# EAGLE design stm32f765-M7 (EAGLE 9.3.0)
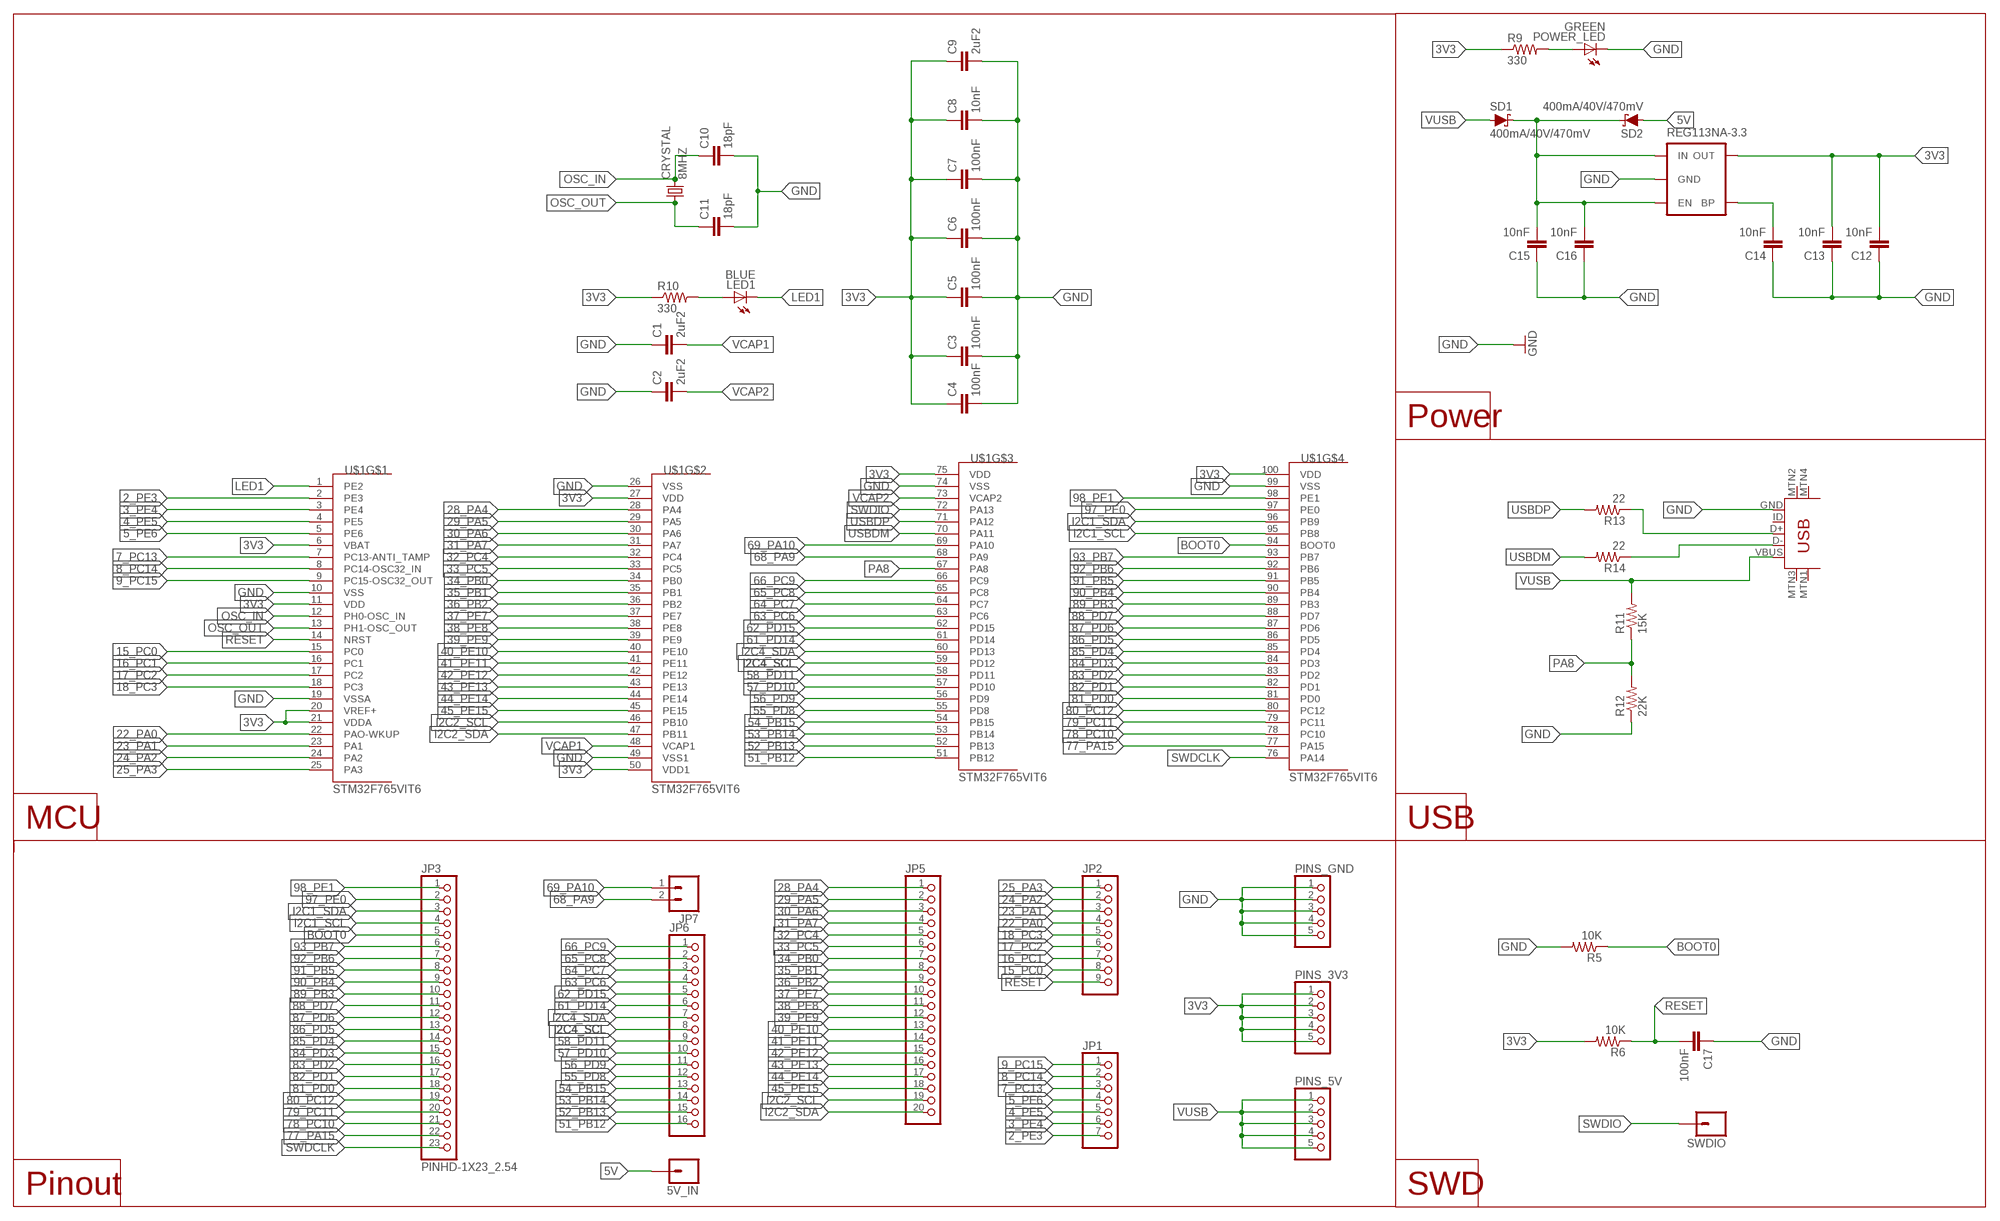
[diagram p0: schematic, sheet 1]

## Parts
5V_IN  M01PTH_LONGPAD  [1X01_LONGPAD]
C1  2uF2  CAP1206  [1206]
C2  2uF2  CAP1206  [1206]
C3  100nF  CAP1206  [1206]
C4  100nF  CAP1206  [1206]
C5  100nF  CAP1206  [1206]
C6  100nF  CAP1206  [1206]
C7  100nF  CAP1206  [1206]
C8  10nF  CAP1206  [1206]
C9  2uF2  CAP1206  [1206]
C10  18pF  CAP1206  [1206]
C11  18pF  CAP1206  [1206]
C12  10nF  CAP1206  [1206]
C13  10nF  CAP1206  [1206]
C14  10nF  CAP1206  [1206]
C15  10nF  CAP1206  [1206]
C16  10nF  CAP1206  [1206]
C17  100nF  CAP1206  [1206]
CRYSTAL  8MHZ  CSM-7X-DU  [CSM-7X-DU]
JP1  PINHD-1X07_2.54  [1X07]
JP2  PINHD-1X09_2.54  [1X09]
JP3  PINHD-1X23_2.54  [1X23]
JP5  PINHD-1X20_2.54  [1X20]
JP6  PINHD-1X16_2.54  [1X16]
JP7  M02  [1X02_LONGPADS]
LED1  BLUE  LED1206  [1206]
PINS_3V3  PINHD-1X05_2.54  [1X05]
PINS_5V  PINHD-1X05_2.54  [1X05]
PINS_GND  PINHD-1X05_2.54  [1X05]
POWER_LED  GREEN  LED1206  [1206]
R5  10K  RESISTOR1206  [1206]
R6  10K  RESISTOR1206  [1206]
R9  330  RESISTOR1206  [1206]
R10  330  RESISTOR1206  [1206]
R11  15K  RESISTOR1206  [1206]
R12  22K  RESISTOR1206  [1206]
R13  22  RESISTOR1206  [1206]
R14  22  RESISTOR1206  [1206]
REG113NA-3.3  V_REG_LDOSMD  [SOT23-5]
SD1  400mA/40V/470mV  DIODE-SCHOTTKY-ZLLS500  [SOT23-3]
SD2  400mA/40V/470mV  DIODE-SCHOTTKY-ZLLS500  [SOT23-3]
SWDIO  M01PTH_LONGPAD  [1X01_LONGPAD]
U$1  STM32F765VIT6  [LQFP100]
U$7  USB-MINIB-5PIN  [USB-MINIB]

## Nets
2_PE3: JP1.7 U$1.2(PE3)
3_PE4: JP1.6 U$1.3(PE4)
3V3: C3.1 C4.1 C5.1 C6.1 C7.1 C8.1 C9.1 C12.2 C13.2 PINS_3V3.1 PINS_3V3.2 PINS_3V3.3 PINS_3V3.4 PINS_3V3.5 R6.2 R9.1 R10.1 REG113NA-3.3.5(OUT) U$1.6(VBAT) U$1.11(VDD) U$1.20(VREF+) U$1.21(VDDA) U$1.27(VDD) U$1.50(VDD1) U$1.75(VDD) U$1.100(VDD)
4_PE5: JP1.5 U$1.4(PE5)
5_PE6: JP1.4 U$1.5(PE6)
5V: 5V_IN.1 SD2.1(A)
7_PC13: JP1.3 U$1.7(PC13-ANTI_TAMP)
8_PC14: JP1.2 U$1.8(PC14-OSC32_IN)
9_PC15: JP1.1 U$1.9(PC15-OSC32_OUT)
15_PC0: JP2.8 U$1.15(PC0)
16_PC1: JP2.7 U$1.16(PC1)
17_PC2: JP2.6 U$1.17(PC2)
18_PC3: JP2.5 U$1.18(PC3)
22_PA0: JP2.4 U$1.22(PAO-WKUP)
23_PA1: JP2.3 U$1.23(PA1)
24_PA2: JP2.2 U$1.24(PA2)
25_PA3: JP2.1 U$1.25(PA3)
28_PA4: JP5.1 U$1.28(PA4)
29_PA5: JP5.2 U$1.29(PA5)
30_PA6: JP5.3 U$1.30(PA6)
31_PA7: JP5.4 U$1.31(PA7)
32_PC4: JP5.5 U$1.32(PC4)
33_PC5: JP5.6 U$1.33(PC5)
34_PB0: JP5.7 U$1.34(PB0)
35_PB1: JP5.8 U$1.35(PB1)
36_PB2: JP5.9 U$1.36(PB2)
37_PE7: JP5.10 U$1.37(PE7)
38_PE8: JP5.11 U$1.38(PE8)
39_PE9: JP5.12 U$1.39(PE9)
40_PE10: JP5.13 U$1.40(PE10)
41_PE11: JP5.14 U$1.41(PE11)
42_PE12: JP5.15 U$1.42(PE12)
43_PE13: JP5.16 U$1.43(PE13)
44_PE14: JP5.17 U$1.44(PE14)
45_PE15: JP5.18 U$1.45(PE15)
51_PB12: JP6.16 U$1.51(PB12)
52_PB13: JP6.15 U$1.52(PB13)
53_PB14: JP6.14 U$1.53(PB14)
54_PB15: JP6.13 U$1.54(PB15)
55_PD8: JP6.12 U$1.55(PD8)
56_PD9: JP6.11 U$1.56(PD9)
57_PD10: JP6.10 U$1.57(PD10)
58_PD11: JP6.9 U$1.58(PD11)
61_PD14: JP6.6 U$1.61(PD14)
62_PD15: JP6.5 U$1.62(PD15)
63_PC6: JP6.4 U$1.63(PC6)
64_PC7: JP6.3 U$1.64(PC7)
65_PC8: JP6.2 U$1.65(PC8)
66_PC9: JP6.1 U$1.66(PC9)
68_PA9: JP7.2 U$1.68(PA9)
69_PA10: JP7.1 U$1.69(PA10)
77_PA15: JP3.22 U$1.77(PA15)
78_PC10: JP3.21 U$1.78(PC10)
79_PC11: JP3.20 U$1.79(PC11)
80_PC12: JP3.19 U$1.80(PC12)
81_PD0: JP3.18 U$1.81(PD0)
82_PD1: JP3.17 U$1.82(PD1)
83_PD2: JP3.16 U$1.83(PD2)
84_PD3: JP3.15 U$1.84(PD3)
85_PD4: JP3.14 U$1.85(PD4)
86_PD5: JP3.13 U$1.86(PD5)
87_PD6: JP3.12 U$1.87(PD6)
88_PD7: JP3.11 U$1.88(PD7)
89_PB3: JP3.10 U$1.89(PB3)
90_PB4: JP3.9 U$1.90(PB4)
91_PB5: JP3.8 U$1.91(PB5)
92_PB6: JP3.7 U$1.92(PB6)
93_PB7: JP3.6 U$1.93(PB7)
97_PE0: JP3.2 U$1.97(PE0)
98_PE1: JP3.1 U$1.98(PE1)
BOOT0: JP3.5 R5.1 U$1.94(BOOT0)
GND: C1.1 C2.1 C3.2 C4.2 C5.2 C6.2 C7.2 C8.2 C9.2 C10.2 C11.2 C12.1 C13.1 C14.1 C15.1 C16.1 C17.1 PINS_GND.1 PINS_GND.2 PINS_GND.3 PINS_GND.4 PINS_GND.5 POWER_LED.2(C) R5.2 R12.1 REG113NA-3.3.2(GND) U$1.10(VSS) U$1.19(VSSA) U$1.26(VSS) U$1.49(VSS1) U$1.74(VSS) U$1.99(VSS) U$7.GND
I2C1_SCL: JP3.4 U$1.95(PB8)
I2C1_SDA: JP3.3 U$1.96(PB9)
I2C2_SCL: JP5.19 U$1.46(PB10)
I2C2_SDA: JP5.20 U$1.47(PB11)
I2C4_SCL: JP6.8 U$1.59(PD12)
I2C4_SDA: JP6.7 U$1.60(PD13)
LED1: LED1.2(C) U$1.1(PE2)
N$1: POWER_LED.1(A) R9.2
N$2: LED1.1(A) R10.2
N$3: C15.2 C16.2 REG113NA-3.3.1(IN) REG113NA-3.3.3(EN) SD1.3(C) SD2.3(C)
N$5: R14.1 U$7.D-
N$6: R13.1 U$7.D+
NR: C14.2 REG113NA-3.3.4(BP)
OSC_IN: C10.1 CRYSTAL.2 U$1.12(PH0-OSC_IN)
OSC_OUT: C11.1 CRYSTAL.1 U$1.13(PH1-OSC_OUT)
PA8: R11.1 R12.2 U$1.67(PA8)
RESET: C17.2 JP2.9 R6.1 U$1.14(NRST)
SWDCLK: JP3.23 U$1.76(PA14)
SWDIO: SWDIO.1 U$1.72(PA13)
USBDM: R14.2 U$1.70(PA11)
USBDP: R13.2 U$1.71(PA12)
VCAP1: C1.2 U$1.48(VCAP1)
VCAP2: C2.2 U$1.73(VCAP2)
VUSB: PINS_5V.1 PINS_5V.2 PINS_5V.3 PINS_5V.4 PINS_5V.5 R11.2 SD1.1(A) U$7.VBUS
Unconnected: U$7.ID U$7.MTN1(MTN2) U$7.MTN2(MTN3) U$7.MTN3(MTN1) U$7.MTN4

## Notes on the sheet
- Power
- MCU | USB
- Pinout | SWD

## Library data of the parts
5V_IN SWDIO = flight_controller.lbr01_SparkFun:M01: Header 1 Standard 1-pin 0.1" header. Use with straight break away headers (SKU : PRT-00116), right angle break away headers (PRT-00553), swiss pins (PRT-00743), machine pins (PRT-00117), and female headers (PRT-00115).
C1-C17 = 01_SparkFun:CAP: Capacitor Standard 0603 ceramic capacitor, and 0.1" leaded capacitor.
CRYSTAL = flight_controller.lbr01_FAB_Hello:CSM-7X-DU: SMD CRYSTAL Source: www.ecsxtal.com .. Crystal 3.6864MHz CSM_7X_DU.PDF; OC_FARNELL: unknown; OC_NEWARK: unknown
JP1 = pinhead-2:PINHD-1X07: PIN HEADER
JP2 = pinhead-2:PINHD-1X09: PIN HEADER
JP3 = pinhead-2:PINHD-1X23: PIN HEADER
JP5 = pinhead-2:PINHD-1X20: PIN HEADER
JP6 = pinhead-2:PINHD-1X16: PIN HEADER
JP7 = flight_controller.lbr01_SparkFun:M02: Header 2 Standard 2-pin 0.1" header. Use with straight break away headers (SKU : PRT-00116), right angle break away headers (PRT-00553), swiss pins (PRT-00743), machine pins (PRT-00117), and female headers (PRT-00115). Molex polarized connector foot print use with SKU : PRT-08233 with associated crimp pins and housings.
LED1 POWER_LED = flight_controller.lbr01_FAB_Hello:LED
PINS_3V3 PINS_5V PINS_GND = pinhead-2:PINHD-1X05: PIN HEADER
R5 R6 R9-R14 = flight_controller.lbr01_SparkFun:RESISTOR: Resistor Basic schematic elements and footprints for 0603, 1206, and PTH 1/10th watt (small) resistors.
REG113NA-3.3 = 01_SparkFun:V_REG_LDO: Voltage Regulator LDO Standard 150mA LDO voltage regulator in SOT-23 layout. Micrel part MIC5205. BP (by-pass) pin is used to lower output noise with 470pF cap.
SD1 SD2 = SparkFun-DiscreteSemi:DIODE-SCHOTTKY: Schottky diode A Schottky diode is a semiconductor diode which has a low forward voltage drop and a very fast switching action.; PROD_ID: DIO-08411; VALUE: 700mA/40V/533mV
U$1 = STM32F765VIT6:STM32F765VIT6: STmicroelectronics Cortex M4 Series Typ: STM32F407Vx LQFP100 Copyright 2012 by Ersan Günes, Quantitec, info@quantitec.de
U$7 = SparkFun:USB-MINIB

## Board
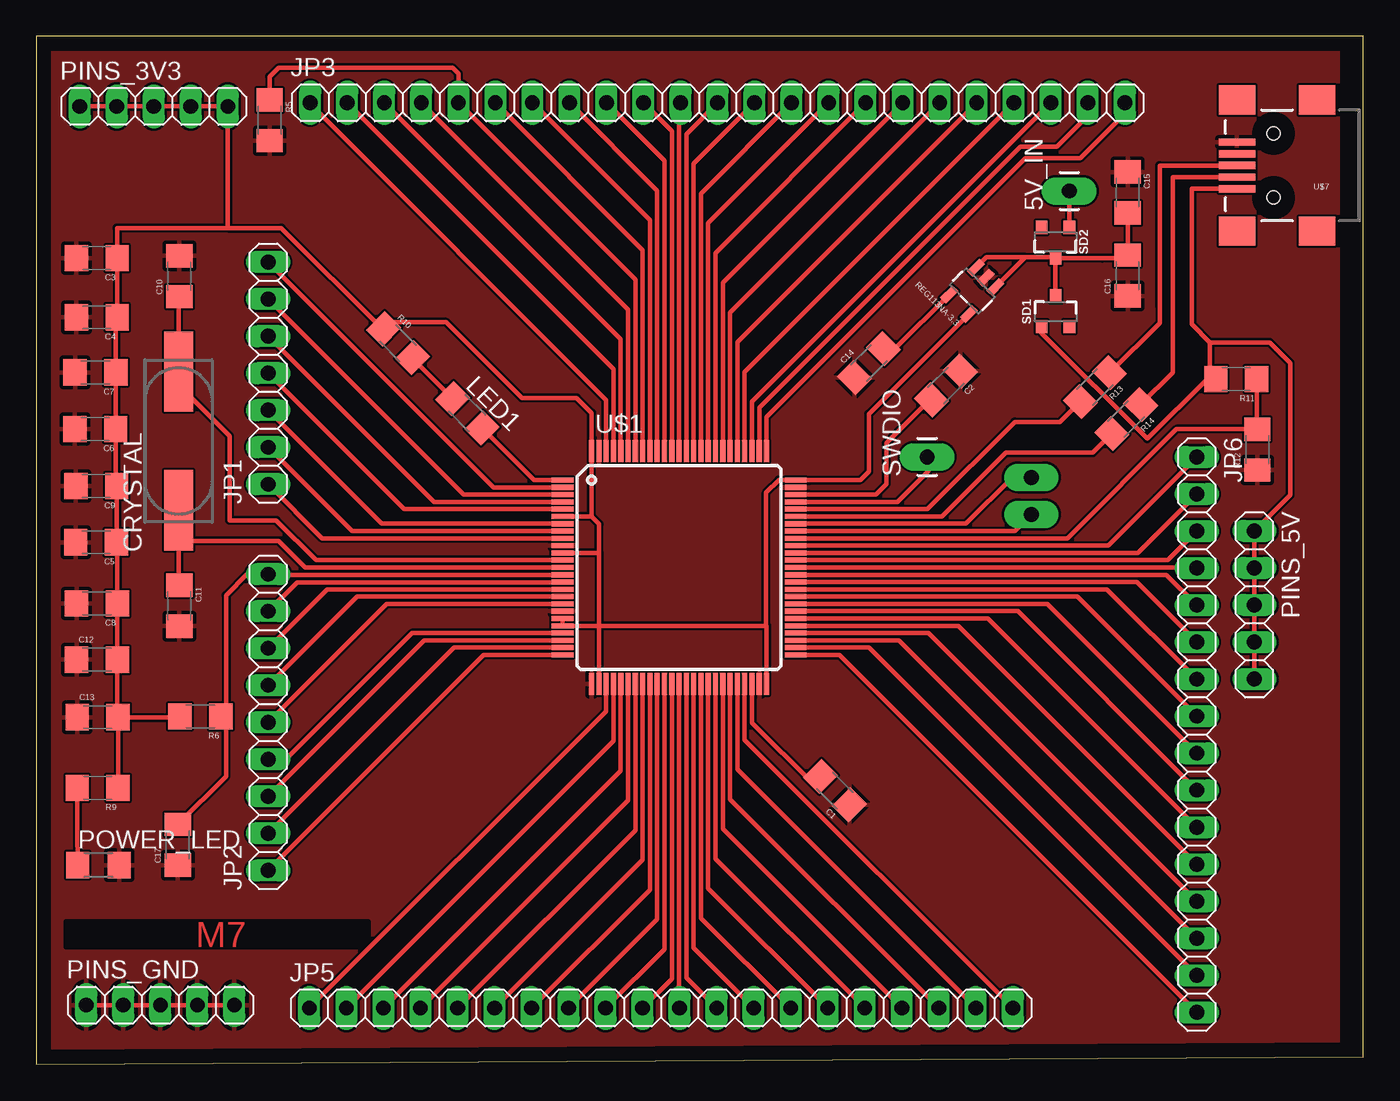
[diagram p1: board, top side]

Size 91 x 70.5 mm. Coordinates in mm from the lower left corner, seen from the top.
Outline: 0,0 91,0.5 91,70.5 0,70.5 0,0
Copper layers (1*16): Top 0.035mm / dielectric 1.5mm / Bottom 0.035mm
Design rules "default": minimum track width 6mil, minimum drill 0.35mm, track to track 6mil, track to pad 6mil, pad to pad 6mil, via to via 6mil, smd to smd 6mil, copper to edge 40mil, drill to drill 6mil, minimum pad ring 10mil, minimum via ring 8mil, stop-mask expansion 4mil, vias tented up to drill 0mil, thermal gap 10mil

### Footprints (pad centres in the part's own frame; a part is rotated, then mirrored left to right if it is on the bottom)
1X01_LONGPAD = drill 1.016 pad 1.88 long: 1 0,0
1206 = smd 1.6 x 1.8: 1 -1.4,0; 2 1.4,0
CSM-7X-DU = smd 5.5 x 2: 1 -4.75,0; 2 4.75,0
1X07 = drill 1.016 long: 1 -7.62,0; 2 -5.08,0; 3 -2.54,0; 4 0,0; 5 2.54,0; 6 5.08,0; 7 7.62,0
1X09 = drill 1.016 long: 1 -10.16,0; 2 -7.62,0; 3 -5.08,0; 4 -2.54,0; 5 0,0; 6 2.54,0; 7 5.08,0; 8 7.62,0; 9 10.16,0
1X23 = drill 1.016 long: 1 -26.67,0; 2 -24.13,0; 3 -21.59,0; 4 -19.05,0; 5 -16.51,0; 6 -13.97,0; 7 -11.43,0; 8 -8.89,0; 9 -6.35,0; 10 -3.81,0; 11 -1.27,0; 12 1.27,0; 13 3.81,0; 14 6.35,0; 15 8.89,0; 16 11.43,0; 17 13.97,0; 18 16.51,0; 19 19.05,0; 20 21.59,0; 21 24.13,0; 22 26.67,0; 23 29.21,0
1X20 = drill 1.016 long: 1 -24.13,0; 2 -21.59,0; 3 -19.05,0; 4 -16.51,0; 5 -13.97,0; 6 -11.43,0; 7 -8.89,0; 8 -6.35,0; 9 -3.81,0; 10 -1.27,0; 11 1.27,0; 12 3.81,0; 13 6.35,0; 14 8.89,0; 15 11.43,0; 16 13.97,0; 17 16.51,0; 18 19.05,0; 19 21.59,0; 20 24.13,0
1X16 = drill 1.016 long: 1 -19.05,0; 2 -16.51,0; 3 -13.97,0; 4 -11.43,0; 5 -8.89,0; 6 -6.35,0; 7 -3.81,0; 8 -1.27,0; 9 1.27,0; 10 3.81,0; 11 6.35,0; 12 8.89,0; 13 11.43,0; 14 13.97,0; 15 16.51,0; 16 19.05,0
1X02_LONGPADS = drill 1.016 pad 1.88 long: 1 0,0; 2 2.54,0
1206' = smd 1.6 x 1.803: 1 -1.422,0; 2 1.422,0
1X05 = drill 1.016 long: 1 -5.08,0; 2 -2.54,0; 3 0,0; 4 2.54,0; 5 5.08,0
SOT23-5 = smd 0.55 x 1.2: 1 -0.95,-1.3; 2 0,-1.3; 3 0.95,-1.3; 4 0.95,1.3; 5 -0.95,1.3
SOT23-3 = smd 0.8 x 0.9: 1 -0.95,-1; 2 0.95,-1; 3 0,1.1
LQFP100 = smd 1.5 x 0.35: 1 -8,6; 2 -8,5.5; 3 -8,5; 4 -8,4.5; 5 -8,4; 6 -8,3.5; 7 -8,3; 8 -8,2.5; 9 -8,2; 10 -8,1.5; 11 -8,1; 12 -8,0.5; 13 -8,0; 14 -8,-0.5; 15 -8,-1; 16 -8,-1.5; 17 -8,-2; 18 -8,-2.5; 19 -8,-3; 20 -8,-3.5; 21 -8,-4; 22 -8,-4.5; 23 -8,-5; 24 -8,-5.5; 25 -8,-6; 51 8,-6; 52 8,-5.5; 53 8,-5; 54 8,-4.5; 55 8,-4; 56 8,-3.5; 57 8,-3; 58 8,-2.5; 59 8,-2; 60 8,-1.5; 61 8,-1; 62 8,-0.5; 63 8,0; 64 8,0.5; 65 8,1; 66 8,1.5; 67 8,2; 68 8,2.5; 69 8,3; 70 8,3.5; 71 8,4; 72 8,4.5; 73 8,5; 74 8,5.5; 75 8,6 | smd 0.35 x 1.5: 26 -6,-8; 27 -5.5,-8; 28 -5,-8; 29 -4.5,-8; 30 -4,-8; 31 -3.5,-8; 32 -3,-8; 33 -2.5,-8; 34 -2,-8; 35 -1.5,-8; 36 -1,-8; 37 -0.5,-8; 38 0,-8; 39 0.5,-8; 40 1,-8; 41 1.5,-8; 42 2,-8; 43 2.5,-8; 44 3,-8; 45 3.5,-8; 46 4,-8; 47 4.5,-8; 48 5,-8; 49 5.5,-8; 50 6,-8; 76 6,8; 77 5.5,8; 78 5,8; 79 4.5,8; 80 4,8; 81 3.5,8; 82 3,8; 83 2.5,8; 84 2,8; 85 1.5,8; 86 1,8; 87 0.5,8; 88 0,8; 89 -0.5,8; 90 -1,8; 91 -1.5,8; 92 -2,8; 93 -2.5,8; 94 -3,8; 95 -3.5,8; 96 -4,8; 97 -4.5,8; 98 -5,8; 99 -5.5,8; 100 -6,8
USB-MINIB = smd 2.5 x 0.5: D+ 2.5,0; D- 2.5,0.8; GND 2.5,-1.6; ID 2.5,-0.8; VBUS 2.5,1.6 | smd 2.5 x 2: MTN1 -3,4.5; MTN2 2.5,4.5; MTN3 -3,-4.5; MTN4 2.5,-4.5 | hole 0.9: 0,2.2; 0,-2.2

### Placement (x,y rotation side)
5V_IN  70.85,59.9 90 top
C1  54.78,18.76 135 top
C2  62.39,46.56 225 top
C3  4.14,55.29 180 top
C4  4.14,51.23 180 top
C5  4.09,35.8 180 top
C6  4.04,43.57 180 top
C7  4.05,47.45 180 top
C8  4.15,31.6 180 top
C9  4.1,39.65 180 top
C10  9.8,54.05 90 top
C11  9.8,31.45 270 top
C12  4.15,27.75 0 top
C13  4.2,23.8 0 top
C14  57.1,48.1 45 top
C15  74.85,59.8 270 top
C16  74.85,54.1 90 top
C17  9.7,15.05 90 top
CRYSTAL  9.75,42.75 90 top
JP1  15.9,47.4 90 top
JP2  15.9,23.45 90 top
JP3  45.45,65.95 0 top
JP5  42.85,3.85 0 top
JP6  79.6,22.6 270 top
JP7  68.25,40.25 270 top
LED1  BLUE  [1206']  29.55,44.65 315 top
PINS_3V3  8.05,65.7 0 top
PINS_5V  83.55,31.5 270 top
PINS_GND  8.5,4.05 0 top
POWER_LED  GREEN  [1206']  4.25,13.65 0 top
R5  16,64.75 270 top
R6  11.25,23.85 180 top
R9  4.2,18.95 180 top
R10  24.8,49.45 315 top
R11  82.3,47 180 top
R12  83.75,42.15 90 top
R13  72.6,46.45 225 top
R14  74.75,44.25 225 top
REG113NA-3.3  64.2,53.05 135 top
SD1  69.9,51.6 0 top
SD2  69.9,56.4 180 top
SWDIO  61.1,41.65 90 top
U$1  44.08,34.07 0 top
U$7  84.85,61.65 180 top

### Tracks (layer width: path | path; a pad name or v marks a point on that pad's centre or on a via)
2_PE3
  Top 0.305: U$1.2 31.35,39.57 JP1.7
3_PE4
  Top 0.305: U$1.3 29.31,39.07 JP1.6
3V3
  Top 0.305: U$1.50 50.08,30.07 50.05,30.07 | 38.58,30.07 U$1.21 U$1.20 | 38.6,30.07 38.58,30.07 | 38.58,30.07 U$1.27 | 38.6,35.07 U$1.11 | 38.6,35.07 38.6,30.07 | 50.05,30.07 38.6,30.07 | 38.6,35.07 38.6,37.05 38.08,37.57 | 38.08,37.57 U$1.6 | 38.08,37.57 U$1.100 38.08,44.67 37.05,45.7 33.3,45.7 28.1,50.9 23.81,50.9 R10.1 23.7,50.44 23.7,50.45 16.8,57.35 13.2,57.35 | 5.54,51.35 C4.1 | 5.54,51.35 C3.1 5.54,57.34 | 5.54,51.35 5.45,51.35 C7.1 C6.1 5.44,39.95 C9.1 C5.1 5.55,35.8 C8.1 C12.2 5.55,23.8 C13.2 | C13.2 R9.1 | 5.54,57.34 5.55,57.35 5.6,57.3 | 5.54,57.34 5.53,57.35 13.2,57.35 | C13.2 9.8,23.8 R6.2 | 50.05,30.07 50.05,39.2 50.92,40.07 U$1.75 56.52,40.07 57.1,40.65 57.1,44.61 REG113NA-3.3.5 | PINS_3V3.2 5.55,65.7 5.55,65.5 | PINS_3V3.1 PINS_3V3.2 | PINS_3V3.2 PINS_3V3.3 PINS_3V3.4 PINS_3V3.5 13.13,57.35 13.2,57.35
4_PE5
  Top 0.305: U$1.4 27.27,38.57 JP1.5
5_PE6
  Top 0.305: U$1.5 25.23,38.07 JP1.4
5V
  Top 0.305: 5V_IN.1 SD2.1
7_PC13
  Top 0.305: U$1.7 23.69,37.07 JP1.3
8_PC14
  Top 0.305: U$1.8 21.65,36.57 JP1.2
9_PC15
  Top 0.305: U$1.9 19.61,36.07 JP1.1
15_PC0
  Top 0.305: U$1.15 36.06,33.05 17.88,33.05 JP2.8
16_PC1
  Top 0.305: U$1.16 19.94,32.57 JP2.7
17_PC2
  Top 0.305: U$1.17 21.98,32.07 JP2.6
18_PC3
  Top 0.305: U$1.18 24.02,31.57 JP2.5
22_PA0
  Top 0.305: U$1.22 25.77,29.57 17.2,21 15.99,21 JP2.4
23_PA1
  Top 0.305: U$1.23 26.6,29.07 JP2.3
24_PA2
  Top 0.305: U$1.24 28.64,28.57 JP2.2
25_PA3
  Top 0.305: U$1.25 30.68,28.07 JP2.1
28_PA4
  Top 0.305: U$1.28 39.08,24.21 JP5.1
29_PA5
  Top 0.305: U$1.29 39.58,22.17 JP5.2
30_PA6
  Top 0.305: U$1.30 40.08,20.13 JP5.3
31_PA7
  Top 0.305: U$1.31 40.58,18.09 JP5.4
32_PC4
  Top 0.305: U$1.32 41.08,16.05 JP5.5
33_PC5
  Top 0.305: U$1.33 41.58,14.01 JP5.6
34_PB0
  Top 0.305: U$1.34 42.08,11.97 JP5.7
35_PB1
  Top 0.305: U$1.35 42.58,9.93 JP5.8
36_PB2
  Top 0.305: U$1.36 43.08,7.89 JP5.9
37_PE7
  Top 0.305: U$1.37 43.58,5.85 JP5.10
38_PE8
  Top 0.305: U$1.38 44.08,3.89 JP5.11
39_PE9
  Top 0.305: U$1.39 44.58,5.93 JP5.12
40_PE10
  Top 0.305: U$1.40 45.08,7.97 JP5.13
41_PE11
  Top 0.305: U$1.41 45.58,10.01 JP5.14
42_PE12
  Top 0.305: U$1.42 46.08,12.05 JP5.15
43_PE13
  Top 0.305: U$1.43 46.58,14.09 JP5.16
44_PE14
  Top 0.305: U$1.44 47.08,16.13 JP5.17
45_PE15
  Top 0.305: U$1.45 47.58,18.17 JP5.18
51_PB12
  Top 0.305: U$1.51 55.08,28.07 JP6.16
52_PB13
  Top 0.305: U$1.52 57.12,28.57 JP6.15
53_PB14
  Top 0.305: U$1.53 59.16,29.07 JP6.14
54_PB15
  Top 0.305: U$1.54 61.2,29.57 JP6.13
55_PD8
  Top 0.305: U$1.55 63.24,30.07 JP6.12
56_PD9
  Top 0.305: U$1.56 65.28,30.57 JP6.11
57_PD10
  Top 0.305: U$1.57 67.32,31.07 JP6.10
58_PD11
  Top 0.305: U$1.58 69.36,31.57 JP6.9
61_PD14
  Top 0.305: U$1.61 75.48,33.07 JP6.6
62_PD15
  Top 0.305: U$1.62 77.52,33.57 JP6.5
63_PC6
  Top 0.305: U$1.63 79.56,34.07 JP6.4
64_PC7
  Top 0.305: U$1.64 77.6,34.57 JP6.3
65_PC8
  Top 0.305: U$1.65 75.56,35.07 JP6.2
66_PC9
  Top 0.305: U$1.66 73.52,35.57 JP6.1
68_PA9
  Top 0.305: U$1.68 67.11,36.57 JP7.2
69_PA10
  Top 0.305: U$1.69 63.77,37.07 66.95,40.25 JP7.1
77_PA15
  Top 0.305: JP3.22 72.12,65.07 70,62.95 67.5,62.95 49.58,45.03 U$1.77
78_PC10
  Top 0.305: U$1.78 49.08,45.45 JP3.21
79_PC11
  Top 0.305: U$1.79 48.58,47.49 JP3.20
80_PC12
  Top 0.305: U$1.80 48.08,49.53 JP3.19
81_PD0
  Top 0.305: U$1.81 47.58,51.57 JP3.18
82_PD1
  Top 0.305: U$1.82 47.08,53.61 JP3.17
83_PD2
  Top 0.305: U$1.83 46.58,55.65 JP3.16
84_PD3
  Top 0.305: U$1.84 46.08,57.69 JP3.15
85_PD4
  Top 0.305: U$1.85 45.58,59.73 JP3.14
86_PD5
  Top 0.305: U$1.86 45.08,61.77 JP3.13
87_PD6
  Top 0.305: U$1.87 44.58,63.81 JP3.12
88_PD7
  Top 0.305: U$1.88 44.08,65.85 JP3.11
89_PB3
  Top 0.305: U$1.89 43.58,64.01 JP3.10
90_PB4
  Top 0.305: U$1.90 43.08,61.97 JP3.9
91_PB5
  Top 0.305: U$1.91 42.58,59.93 JP3.8
92_PB6
  Top 0.305: U$1.92 42.08,57.89 JP3.7
93_PB7
  Top 0.305: U$1.93 41.58,55.85 JP3.6
97_PE0
  Top 0.305: U$1.97 39.58,47.69 JP3.2
98_PE1
  Top 0.305: U$1.98 39.08,45.57 18.78,65.87 JP3.1
BOOT0
  Top 0.305: 41.1,42.09 U$1.94 41.08,53.81 JP3.5 28.94,67.96 28.55,68.35 16.6,68.35 16,67.75 R5.1
GND
  Top 0.305: PINS_GND.5 PINS_GND.4 PINS_GND.3 PINS_GND.2 PINS_GND.1
  pour Top (isolate 0.15): 0.5,69.95 0.5,0.95 89.25,0.95 89.25,69.95
I2C1_SCL
  Top 0.305: U$1.95 40.58,51.77 JP3.4
I2C1_SDA
  Top 0.305: U$1.96 40.08,49.73 JP3.3
I2C2_SCL
  Top 0.305: U$1.46 48.08,20.21 JP5.19
I2C2_SDA
  Top 0.305: U$1.47 48.58,22.25 JP5.20
I2C4_SCL
  Top 0.305: U$1.59 71.4,32.07 JP6.8
I2C4_SDA
  Top 0.305: U$1.60 73.44,32.57 JP6.7
LED1
  Top 0.305: U$1.1 34.13,40.07 LED1.2
N$1
  Top 0.305: R9.2 2.8,16.15 POWER_LED.1
N$2
  Top 0.305: LED1.1 25.79,48.41 R10.2
N$3
  Top 0.305: REG113NA-3.3.1 67.84,55.35 | 67.84,55.35 65.16,55.35 REG113NA-3.3.3 | 67.84,55.35 69.85,55.35 SD2.3 | SD1.3 SD2.3 | 73.05,55.3 73.2,55.3 | 73.05,55.3 SD2.3 | C15.2 C16.2 74.65,55.3 73.05,55.3
N$5
  Top 0.305: 75.99,45.24 R14.1 77.95,47.45 77.95,60.85 U$7.D-
N$6
  Top 0.305: 77.05,52.25 77.05,52 | 77.05,52 77.05,50.85 73.64,47.44 R13.1 | 77.05,52 77.05,61.65 U$7.D+
NR
  Top 0.305: REG113NA-3.3.4 58.9,49.09 C14.2
OSC_IN
  Top 0.305: U$1.12 19.18,34.57 16.45,37.3 13.25,37.3 13.25,43.1 9.75,46.6 CRYSTAL.2 9.75,52.6 C10.1
OSC_OUT
  Top 0.305: U$1.13 18.43,34.07 16.6,35.9 9.85,35.9 9.85,35.95 9.75,35.95 CRYSTAL.1 9.75,32.9 C11.1
PA8
  Top 0.305: U$1.67 70.72,36.07 78.2,43.55 83.65,43.55 | 83.65,43.55 R12.2 | R11.1 83.7,43.6 83.65,43.55
RESET
  Top 0.305: U$1.14 15.94,33.57 JP2.9 14.46,33.61 13,32.15 13,24.2 12.93,24.12 | C17.2 13,19.75 13,24.05 12.93,24.12 | 12.93,24.12 R6.1
SWDCLK
  Top 0.305: U$1.76 50.08,44.38 67.85,62.15 71.6,62.15 74.66,65.21 JP3.23
SWDIO
  Top 0.305: U$1.72 59.07,38.57 61.2,40.7 61.2,41.55 SWDIO.1
USBDM
  Top 0.305: U$1.70 62.12,37.57 66.5,41.95 72.45,41.95 R14.2
USBDP
  Top 0.305: U$1.71 61.12,38.07 67.1,44.05 70.2,44.05 R13.2
VCAP1
  Top 0.305: U$1.48 49.08,23.42 53.25,19.25 53.3,19.25 C1.2
VCAP2
  Top 0.305: U$1.73 57.57,39.07 58.3,39.8 58.3,42.6 61.27,45.57 C2.2
VUSB
  Top 0.305: 80.5,47 R11.2 | 80.5,47 80.3,47 76.2,42.9 68.95,50.15 SD1.1 | 80.5,49.5 80.5,47 | PINS_5V.5 PINS_5V.4 PINS_5V.3 PINS_5V.2 PINS_5V.1 86,39.03 86,48.1 84.6,49.5 80.5,49.5 | U$7.VBUS 79.25,60.05 79.25,50.75 80.5,49.5

### Text on the board
Top: M7